# Altium schematic sheet driver_isolated_opto.SchDoc
size A
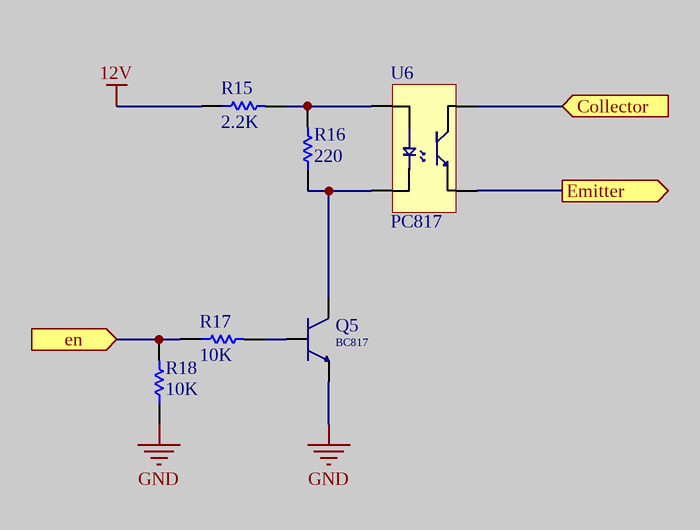
[diagram p0: driver_isolated_opto.SchDoc]

## Parts
Q5  NPN transistor  [NPN]  (value not drawn)
R15  2.2K  [RESC0603]
R16  220  [RESC0603]
R17  10K  [RESC0603]
R18  10K  [RESC0603]
U6  PC817  [PC817]

## Ports
Collector (in), Emitter (out), en (in)

## Nets
12V: R15.1
GND: Q5.2(E) R18.1
Collector: U6.4 ; port Collector
Emitter: U6.3 ; port Emitter
en: R17.1 R18.2 ; port en
NetQ5_1: Q5.1(B) R17.2
NetQ5_3: Q5.3(C) R16.1 U6.2
NetR15_2: R15.2 R16.2 U6.1

## Library data of the parts
Q5 = BC817: 45 V, 0.5 A; Transistor: BC817
R15-R18 = Resistor: 0603,0.1W; Published: 8-Jun-2000; LatestRevisionDate: 17-Jul-2002; LatestRevisionNote: Re-released for DXP Platform.; PackageReference: AXIAL-0.5; Publisher: Altium Limited
  R15: Value: 2.2K
  R16: Value: 220
  R17 R18: Value: 10K
U6 = PC817: PC817 optocoupler